# Altium schematic sheet bias.SchDoc: Bias Driver
size A4; Author: Peter Tanner; SheetNumber: 5; SheetTotal: 9
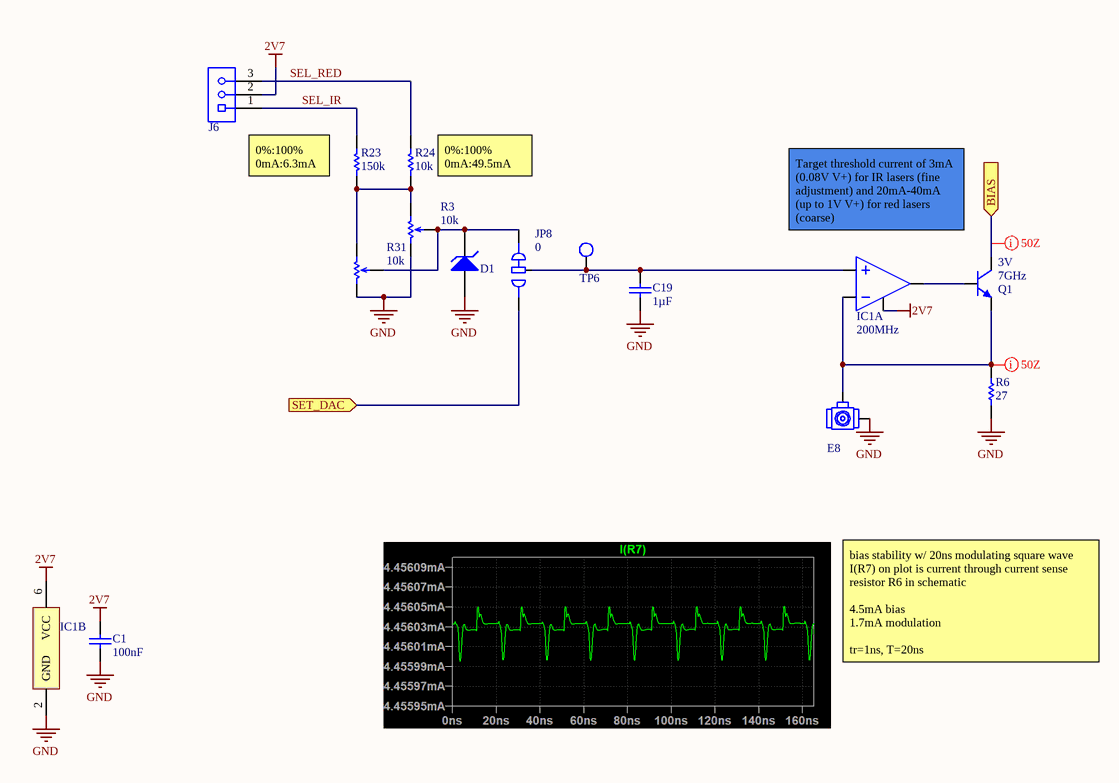
[diagram p0: bias.SchDoc]

## Parts
C1  value 100nF  [CAPC1005X06N]  (hidden comment: CL05B104KB54PNC)
C19  value 1µF  [CAPC1005X06N]  (hidden comment: CL05A105KA5NQNC)
D1  H5VU10U  [DFN60P100X45-2L]  (value not drawn)
E8  U.FL-R-SMT-1(01)  [HRS-U.FL-R-SMT-3_V 4_LAYER_KO]  (value not drawn)
IC1  Gain Bandwidth Product: 200MHz  [DBV0006A_SOT-23-6_TI__SOT95P280X145-6L]  (hidden comment: OPA355NA/3K)  (parts A,B of 2)
J6  10129378-903001BLF  [10129378-903001BLF-Footprint-1]  (value not drawn)
JP8  value 0  [RESC1005X04N TWO STATE]  (hidden comment: JUMPER-0402 TWO STATE)
Q1  Frequency: 7GHz  Emitter Base Voltage (VEBO): 3V  [SOT-23_hongjiacheng__SOT95P240X115-3L]  (hidden comment: 2SC3356)
R3  value 10k  [BOUR-TC33X-2_V]  (hidden comment: TC33X-2-103E)
R6  value 27  [RESC1608X05N]  (hidden comment: ERJ-3GEYJ270V)
R23  value 150k  [RESC2012X05N]  (hidden comment: 0805W8F1503T5E)
R24  value 10k  [RESC2012X05N]  (hidden comment: 0805W8F1002T5E)
R31  value 10k  [POT_RK0971-L-15KC_N-1]  (hidden comment: RK0971114D0B)
TP6  Test Point 5001  [FP-5001-MFG]  (value not drawn)

## Ports
BIAS (in), SET_DAC (in)

## Nets
2V7: C1.2 IC1.5(ENABLE) IC1.6(VCC) J6.2
GND: C1.1 C19.1 D1.2(A) E8.2(GND) IC1.2(GND) R3.1(CCW) R6.1 R31.1(CCW)
BIAS: Q1.1(C) ; port BIAS
SEL_IR: J6.1 R23.2
SEL_RED: J6.3 R24.2
SET_DAC: JP8.1 ; port SET_DAC
NetC19_2: C19.2 IC1.3(VIN+) JP8.3(COM) TP6.1
NetD1_1: D1.1(K) JP8.2 R3.2(W) R31.2(W)
NetE8_1: E8.1(SIG) IC1.4(VIN-) Q1.3(E) R6.2
NetIC1_1: IC1.1(VOUT) Q1.2(B)
NetR3_3: R3.3(CW) R23.1 R24.1 R31.3(CW)

## Layout directives
net class 50Z: BIAS, NetE8_1

## Notes on the sheet
- 0%:100%
  0mA:6.3mA
- 0%:100%
  0mA:49.5mA
- Target threshold current of 3mA (0.08V V+) for IR lasers (fine adjustment) and 20mA-40mA (up to 1V V+) for red lasers (coarse)
- bias stability w/ 20ns modulating square wave
  I(R7) on plot is current through current sense resistor R6 in schematic
  4.5mA bias
  1.7mA modulation
  tr=1ns, T=20ns
- Title:
- Designer:
- Date:
- Size:
- Revision:
- A4
- Sheet:
- 35 Stirling Hwy, Perth WA 6009, Australia

## Library data of the parts
C1 = CMP-00074-10: Ceramic Capacitor, Multilayer, Ceramic, 50V, 10% +Tol, 10% -Tol, X7R, 15% TC, 0.1uF, Surface Mount, 0402; Dielectric: X7R; RoHS Compliant: Yes; Case Code (Imperial): 0402; Tolerance: 10%; JLC_PN: C307331; Voltage Rating: 50V; Source: JLCPCB(Basic)
C19 = CMP-00190-9: Ceramic Capacitor, Multilayer, Ceramic, 25V, 10% +Tol, 10% -Tol, X5R, 15% TC, 1uF, Surface Mount, 0402; JLC_PN: C52923; RoHS Compliant: Yes; Source: JLCPCB(Basic); Voltage Rating: 25V; Case Code (Imperial): 0402; Dielectric: X5R; Tolerance: 10%
D1 = CMP-00841-4: 5A 55W 16V 9V Unidirectional 5V DFN1006-2L  ESD and Surge Protection (TVS/ESD) ROHS; Capacitance: 0.8pF; Breakdown Voltage: 9V; Source: JLCPCB(Basic); Value: 5V; JLC_PN: C22395519; Polarity: Unidirectional; RoHS Compliant: Unsure; Package: DFN1006-2L; Peak Pulse Power Dissipation: 55W; Clamping Voltage: 16V
E8 = CMP-00380-18: Rf Connectors / Coaxial Connectors SMT Ml Rec Au 50 Ohm W/anti Sldr Wicking UFL; Number of Ports: 1; Dielectric Material: Polymer; Impedance: 50; Mating Cycles: 30; Connector Type: Receptacle,Male Pin; Body Plating: Silver; Center Contact Plating: Gold; Max Frequency: 6GHz; Body Material: Bronze; Lead Free: Lead Free; Series: U.FL; JLC PN: C88374; Contact Material: Brass; Fastening Type: SNAP-ON; Min Operating Temperature: -40°C; RoHS Compliant: Yes; Housing Color: Beige; Depth: 3mm; Contact Plating: Gold; Mount: Surface Mount; Length: 3.1mm; Orientation: Vertical; Termination: Solder; Max Operating Temperature: 90°C; Source: UWAA_Stock
IC1 = CMP-00897-1: Operational Amplifier, 1 Func, 9000uV Offset-Max, 100MHz Band Width, CMOS, PDSO6; Output Current per Channel: 60mA; Operating Supply Current: 11mA; Max Supply Voltage: 5.5V; Input Bias Current: 50pA; Input Offset Voltage (Vos): 9mV; Slew Rate: 300V/µs; Power Supply Rejection Ratio (PSRR): 88dB; Min Supply Voltage: 2.7V; Number of Channels: 1; Voltage Gain: 10000; Common Mode Rejection Ratio: 80dB; Source: JLCPCB(Extended,Economic_PCBA); RoHS Compliant: Yes; Quiescent Current: 11mA; Case/Package: SOT-23-6; JLC_PN: C2058090
J6 = CMP-00188-3: Conn Unshrouded Header HDR 3 POS 2.54mm Solder ST Thru-Hole Poly Bag; RoHS Compliant: Unsure; Source: Aliexpress
JP8 = CMP-009-00003-3: JUMPER-0402 TWO STATE Fixed Resistor, Metal Glaze/thick Film, 0.1W, 0ohm, Surface Mount, 0402; Tolerance: 1%; Power Rating: 100mW; Source: JLCPCB(Basic); JLC_PN: C17168; Case Code (Imperial): 0402; RoHS Compliant: Yes
Q1 = CMP-00894-2: RF Small Signal Bipolar Transistor, 0.1A I(C), 1-Element, Ultra High Frequency Band, Silicon, NPN; pin to pad: 1>3 2>1 3>2; Max Collector Current: 100mA; DC Current Gain-Min (hFE): 50; Max Power Dissipation: 200mW; Collector-emitter Voltage Max: 12V; Collector Base Voltage (VCBO): 20V; Source: JLCPCB(Basic); Polarity: NPN; Case/Package: SOT-23; RoHS Compliant: Yes; JLC_PN: C28646266
R3 = CMP-00586-3: Res Trimmer 10K Ohm 25% 1/10W 1(Elec)/1(Mech)Turn (3 X 3.8mm) Foot Print SMD Embossed T/R; Power Rating: 100mW; Temperature Coefficient: 250ppm/°C; Source: JLCPCB(Basic); RoHS Compliant: Unsure; Case Code (Imperial): 0402; Tolerance: 25%
R6 = CMP-00490-4: Res Thick Film 0603 27 Ohm 5% 1/10W +/-200ppm/ßC Molded SMD Punched Carrier T/R; Power Rating: 100mW; Voltage Rating: 75V; Temperature Coefficient: 200ppm/°C; Source: JLCPCB(Basic); Case Code (Imperial): 0603; JLC_PN: C25190; RoHS Compliant: Yes; Tolerance: 5%
R23 = CMP-077-000023-1: Thick Film Resistors - SMD RMC 0805 1/8W 1% T/R-5000; Voltage Rating: 150V; Power Rating: 125mW; RoHS Compliant: Unsure; JLC_PN: C17470; Tolerance: 1%; Source: JLCPCB(Basic); Case Code (Imperial): 0402
R24 = CMP-077-000024-1: Res Thick Film 0805 10K Ohm 1% 0.125W(1/8W) ±100ppm/C Pad SMD T/R; Voltage Rating: 150V; Power Rating: 125mW; Case Code (Imperial): 0805; JLC_PN: C17414; Tolerance: 1%; Source: JLCPCB(Basic); RoHS Compliant: Unsure
R31 = CMP-077-000032-3: Potentiometer, 0.05W, 10000ohm, 10V, 20% +/-Tol, 1 Turn(s); Power Rating: 50mW; RoHS Compliant: Unsure; Case Code (Imperial): N/A; Voltage Rating: 10V; Tolerance: 20%; Source: Aliexpress
TP6 = CMP-001-0013-1: MS27478 - Connectors Receptacle Electrical Solder Mounting Solder Type Hermetic Seal 38999 Series II Test Point; Voltage Rating: 0V; Current Rating: 0A; Number of Contacts: 1; Contact Material: Silver; RoHS Compliant: Unsure; Housing Color: Black; Height: 4.72mm; Length: 7.62mm; Orientation: Straight; Termination: Through Hole; Gender: -; Mounting Technology: Through Hole; Number of Rows: 1; Source: UWAA_Stock; Contact Plating: Tin